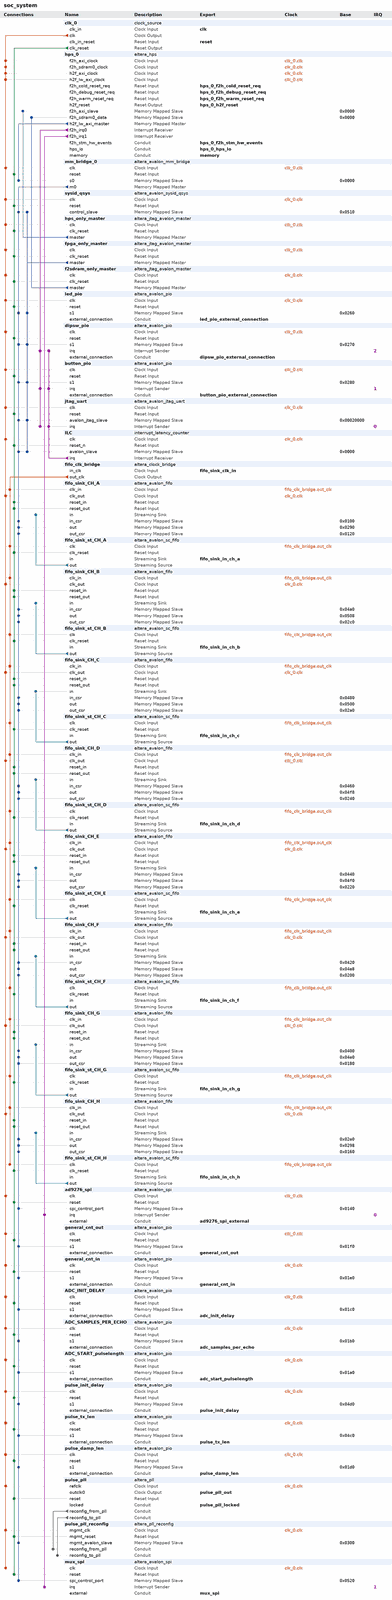
[diagram p0: system contents, whole]
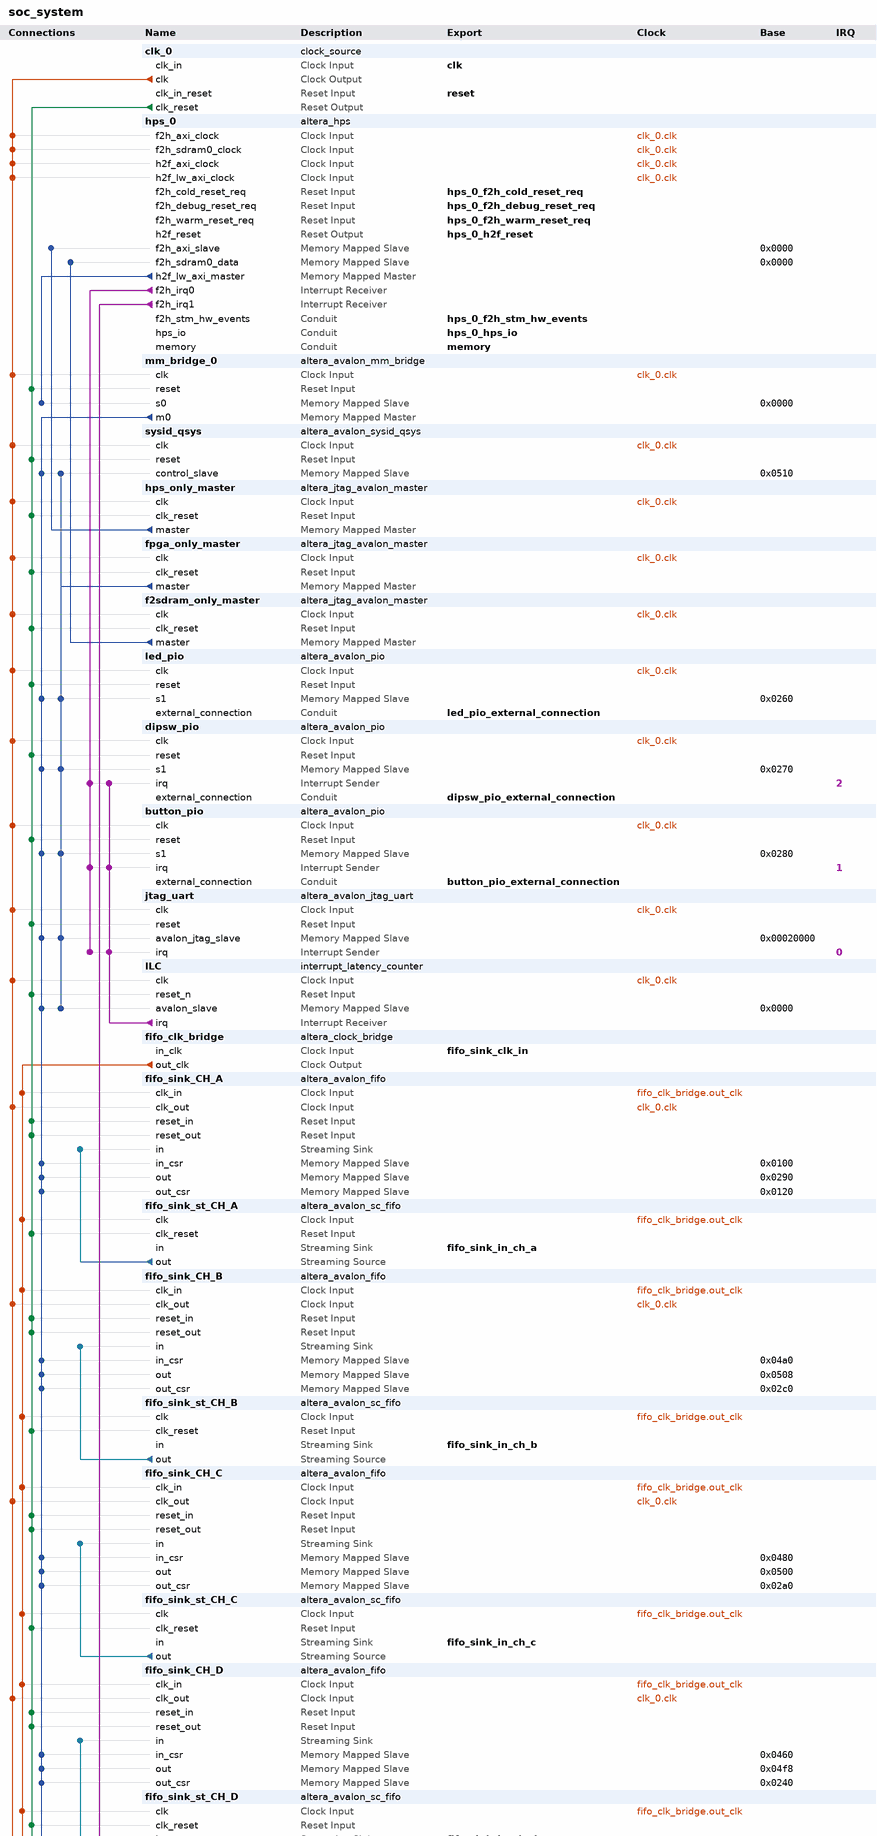
[diagram p1: system contents, upper part]
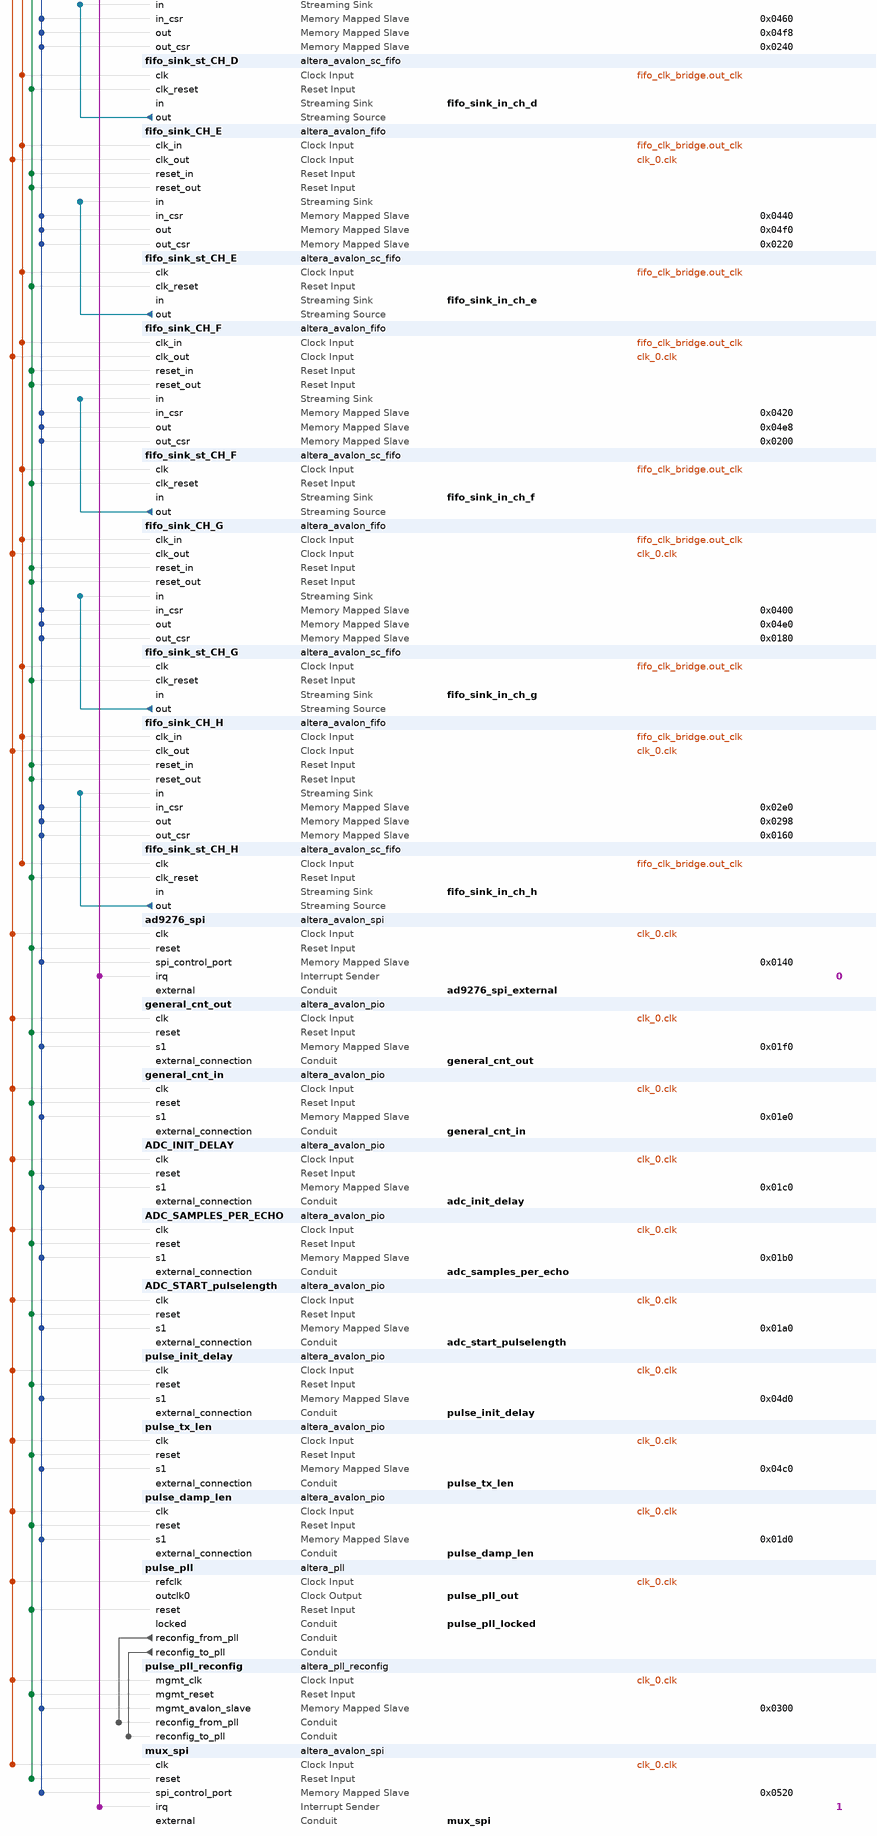
[diagram p2: system contents, lower part]
# Platform Designer (Qsys) system soc_system, Cyclone V 5CSXFC6D6F31C6
# Parameters at their usual value, and those the tool derives, are not listed.
package require -exact qsys 17.1
create_system soc_system
set_project_property DEVICE_FAMILY {Cyclone V}
set_project_property DEVICE 5CSXFC6D6F31C6

add_instance clk_0 clock_source 17.1
set_instance_parameter_value clk_0 clockFrequency 50000000

add_instance hps_0 altera_hps 17.1
set_instance_parameter_value hps_0 EMAC1_Mode RGMII
set_instance_parameter_value hps_0 EMAC1_PinMuxing {HPS I/O Set 0}
set_instance_parameter_value hps_0 F2SCLK_COLDRST_Enable true
set_instance_parameter_value hps_0 F2SCLK_DBGRST_Enable true
set_instance_parameter_value hps_0 F2SCLK_WARMRST_Enable true
set_instance_parameter_value hps_0 F2SDRAM_Type {Avalon-MM Bidirectional}
set_instance_parameter_value hps_0 F2SDRAM_Width 256
set_instance_parameter_value hps_0 F2SINTERRUPT_Enable true
set_instance_parameter_value hps_0 F2S_Width 2
set_instance_parameter_value hps_0 FPGA_PERIPHERAL_OUTPUT_CLOCK_FREQ_EMAC0_GTX_CLK 100
set_instance_parameter_value hps_0 FPGA_PERIPHERAL_OUTPUT_CLOCK_FREQ_EMAC0_MD_CLK 100.0
set_instance_parameter_value hps_0 FPGA_PERIPHERAL_OUTPUT_CLOCK_FREQ_EMAC1_GTX_CLK 100
set_instance_parameter_value hps_0 FPGA_PERIPHERAL_OUTPUT_CLOCK_FREQ_EMAC1_MD_CLK 100.0
set_instance_parameter_value hps_0 HPS_PROTOCOL DDR3
set_instance_parameter_value hps_0 I2C0_Mode I2C
set_instance_parameter_value hps_0 I2C0_PinMuxing {HPS I/O Set 0}
set_instance_parameter_value hps_0 I2C1_Mode I2C
set_instance_parameter_value hps_0 I2C1_PinMuxing {HPS I/O Set 0}
set_instance_parameter_value hps_0 LWH2F_Enable true
set_instance_parameter_value hps_0 MEM_BANKADDR_WIDTH 3
set_instance_parameter_value hps_0 MEM_CLK_FREQ 400.0
set_instance_parameter_value hps_0 MEM_COL_ADDR_WIDTH 10
set_instance_parameter_value hps_0 MEM_DQ_WIDTH 32
set_instance_parameter_value hps_0 MEM_DRV_STR RZQ/6
set_instance_parameter_value hps_0 MEM_ROW_ADDR_WIDTH 15
set_instance_parameter_value hps_0 MEM_RTT_NOM RZQ/6
set_instance_parameter_value hps_0 MEM_RTT_WR {Dynamic ODT off}
set_instance_parameter_value hps_0 MEM_TCL 11
set_instance_parameter_value hps_0 MEM_TFAW_NS 45.0
set_instance_parameter_value hps_0 MEM_TRAS_NS 35.0
set_instance_parameter_value hps_0 MEM_TRCD_NS 13.75
set_instance_parameter_value hps_0 MEM_TRFC_NS 260.0
set_instance_parameter_value hps_0 MEM_TRP_NS 13.75
set_instance_parameter_value hps_0 MEM_VENDOR Micron
set_instance_parameter_value hps_0 MEM_WTCL 7
set_instance_parameter_value hps_0 QSPI_Mode {1 SS}
set_instance_parameter_value hps_0 QSPI_PinMuxing {HPS I/O Set 0}
set_instance_parameter_value hps_0 REF_CLK_FREQ 25.0
set_instance_parameter_value hps_0 S2FCLK_USER2CLK 5
set_instance_parameter_value hps_0 S2F_Width 2
set_instance_parameter_value hps_0 SDIO_Mode {4-bit Data}
set_instance_parameter_value hps_0 SDIO_PinMuxing {HPS I/O Set 0}
set_instance_parameter_value hps_0 SPIM0_Mode {Single Slave Select}
set_instance_parameter_value hps_0 SPIM0_PinMuxing {HPS I/O Set 0}
set_instance_parameter_value hps_0 SPIM1_Mode {Single Slave Select}
set_instance_parameter_value hps_0 SPIM1_PinMuxing {HPS I/O Set 0}
set_instance_parameter_value hps_0 STM_Enable true
set_instance_parameter_value hps_0 TIMING_BOARD_AC_SKEW 0.02
set_instance_parameter_value hps_0 TIMING_BOARD_AC_TO_CK_SKEW 0.01
set_instance_parameter_value hps_0 TIMING_BOARD_DQ_TO_DQS_SKEW 0.05
set_instance_parameter_value hps_0 TIMING_BOARD_MAX_CK_DELAY 0.03
set_instance_parameter_value hps_0 TIMING_BOARD_MAX_DQS_DELAY 0.02
set_instance_parameter_value hps_0 TIMING_BOARD_SKEW_BETWEEN_DQS 0.06
set_instance_parameter_value hps_0 TIMING_BOARD_SKEW_CKDQS_DIMM_MAX 0.12
set_instance_parameter_value hps_0 TIMING_BOARD_SKEW_CKDQS_DIMM_MIN 0.06
set_instance_parameter_value hps_0 TIMING_BOARD_SKEW_WITHIN_DQS 0.01
set_instance_parameter_value hps_0 TIMING_TDH 65
set_instance_parameter_value hps_0 TIMING_TDQSCK 255
set_instance_parameter_value hps_0 TIMING_TDQSQ 125
set_instance_parameter_value hps_0 TIMING_TDS 30
set_instance_parameter_value hps_0 TIMING_TIH 140
set_instance_parameter_value hps_0 TIMING_TIS 190
set_instance_parameter_value hps_0 TIMING_TQSH 0.4
set_instance_parameter_value hps_0 UART0_Mode {No Flow Control}
set_instance_parameter_value hps_0 UART0_PinMuxing {HPS I/O Set 0}
set_instance_parameter_value hps_0 USB1_Mode SDR
set_instance_parameter_value hps_0 USB1_PinMuxing {HPS I/O Set 0}
set_instance_parameter_value hps_0 desired_cfg_clk_mhz 100.0
set_instance_parameter_value hps_0 desired_qspi_clk_mhz 400.0

add_instance mm_bridge_0 altera_avalon_mm_bridge 17.1
set_instance_parameter_value mm_bridge_0 ADDRESS_UNITS SYMBOLS
set_instance_parameter_value mm_bridge_0 ADDRESS_WIDTH 10
set_instance_parameter_value mm_bridge_0 DATA_WIDTH 32
set_instance_parameter_value mm_bridge_0 MAX_PENDING_RESPONSES 4
set_instance_parameter_value mm_bridge_0 USE_AUTO_ADDRESS_WIDTH 1

add_instance sysid_qsys altera_avalon_sysid_qsys 17.1
set_instance_parameter_value sysid_qsys id -1395322110

add_instance hps_only_master altera_jtag_avalon_master 17.1

add_instance fpga_only_master altera_jtag_avalon_master 17.1

add_instance f2sdram_only_master altera_jtag_avalon_master 17.1

add_instance led_pio altera_avalon_pio 17.1
set_instance_parameter_value led_pio direction Output
set_instance_parameter_value led_pio width 10

add_instance dipsw_pio altera_avalon_pio 17.1
set_instance_parameter_value dipsw_pio bitClearingEdgeCapReg true
set_instance_parameter_value dipsw_pio captureEdge true
set_instance_parameter_value dipsw_pio direction Input
set_instance_parameter_value dipsw_pio edgeType ANY
set_instance_parameter_value dipsw_pio generateIRQ true
set_instance_parameter_value dipsw_pio irqType EDGE
set_instance_parameter_value dipsw_pio width 10

add_instance button_pio altera_avalon_pio 17.1
set_instance_parameter_value button_pio bitClearingEdgeCapReg true
set_instance_parameter_value button_pio captureEdge true
set_instance_parameter_value button_pio direction Input
set_instance_parameter_value button_pio edgeType FALLING
set_instance_parameter_value button_pio generateIRQ true
set_instance_parameter_value button_pio irqType EDGE
set_instance_parameter_value button_pio width 4

add_instance jtag_uart altera_avalon_jtag_uart 17.1
set_instance_parameter_value jtag_uart allowMultipleConnections true
set_instance_parameter_value jtag_uart simInteractiveOptions INTERACTIVE_ASCII_OUTPUT

add_instance ILC interrupt_latency_counter 17.1

add_instance fifo_clk_bridge altera_clock_bridge 17.1
set_instance_parameter_value fifo_clk_bridge DERIVED_CLOCK_RATE 0
set_instance_parameter_value fifo_clk_bridge EXPLICIT_CLOCK_RATE 0

add_instance fifo_sink_CH_A altera_avalon_fifo 17.1
set_instance_parameter_value fifo_sink_CH_A bitsPerSymbol 16
set_instance_parameter_value fifo_sink_CH_A channelWidth 0
set_instance_parameter_value fifo_sink_CH_A errorWidth 0
set_instance_parameter_value fifo_sink_CH_A fifoDepth 4096
set_instance_parameter_value fifo_sink_CH_A fifoInputInterfaceOptions AVALONST_SINK
set_instance_parameter_value fifo_sink_CH_A fifoOutputInterfaceOptions AVALONMM_READ
set_instance_parameter_value fifo_sink_CH_A singleClockMode false
set_instance_parameter_value fifo_sink_CH_A symbolsPerBeat 2
set_instance_parameter_value fifo_sink_CH_A useIRQ false
set_instance_parameter_value fifo_sink_CH_A usePacket false
set_instance_parameter_value fifo_sink_CH_A useReadControl true

add_instance fifo_sink_st_CH_A altera_avalon_sc_fifo 17.1
set_instance_parameter_value fifo_sink_st_CH_A BITS_PER_SYMBOL 16
set_instance_parameter_value fifo_sink_st_CH_A CHANNEL_WIDTH 0
set_instance_parameter_value fifo_sink_st_CH_A ERROR_WIDTH 0
set_instance_parameter_value fifo_sink_st_CH_A FIFO_DEPTH 16
set_instance_parameter_value fifo_sink_st_CH_A USE_FILL_LEVEL 0
set_instance_parameter_value fifo_sink_st_CH_A USE_MEMORY_BLOCKS 1
set_instance_parameter_value fifo_sink_st_CH_A USE_STORE_FORWARD 0

add_instance fifo_sink_CH_B altera_avalon_fifo 17.1
set_instance_parameter_value fifo_sink_CH_B bitsPerSymbol 16
set_instance_parameter_value fifo_sink_CH_B channelWidth 0
set_instance_parameter_value fifo_sink_CH_B errorWidth 0
set_instance_parameter_value fifo_sink_CH_B fifoDepth 4096
set_instance_parameter_value fifo_sink_CH_B fifoInputInterfaceOptions AVALONST_SINK
set_instance_parameter_value fifo_sink_CH_B fifoOutputInterfaceOptions AVALONMM_READ
set_instance_parameter_value fifo_sink_CH_B singleClockMode false
set_instance_parameter_value fifo_sink_CH_B symbolsPerBeat 2
set_instance_parameter_value fifo_sink_CH_B useIRQ false
set_instance_parameter_value fifo_sink_CH_B usePacket false
set_instance_parameter_value fifo_sink_CH_B useReadControl true

add_instance fifo_sink_st_CH_B altera_avalon_sc_fifo 17.1
set_instance_parameter_value fifo_sink_st_CH_B BITS_PER_SYMBOL 16
set_instance_parameter_value fifo_sink_st_CH_B CHANNEL_WIDTH 0
set_instance_parameter_value fifo_sink_st_CH_B ERROR_WIDTH 0
set_instance_parameter_value fifo_sink_st_CH_B FIFO_DEPTH 16
set_instance_parameter_value fifo_sink_st_CH_B USE_FILL_LEVEL 0
set_instance_parameter_value fifo_sink_st_CH_B USE_MEMORY_BLOCKS 1
set_instance_parameter_value fifo_sink_st_CH_B USE_STORE_FORWARD 0

add_instance fifo_sink_CH_C altera_avalon_fifo 17.1
set_instance_parameter_value fifo_sink_CH_C bitsPerSymbol 16
set_instance_parameter_value fifo_sink_CH_C channelWidth 0
set_instance_parameter_value fifo_sink_CH_C errorWidth 0
set_instance_parameter_value fifo_sink_CH_C fifoDepth 4096
set_instance_parameter_value fifo_sink_CH_C fifoInputInterfaceOptions AVALONST_SINK
set_instance_parameter_value fifo_sink_CH_C fifoOutputInterfaceOptions AVALONMM_READ
set_instance_parameter_value fifo_sink_CH_C singleClockMode false
set_instance_parameter_value fifo_sink_CH_C symbolsPerBeat 2
set_instance_parameter_value fifo_sink_CH_C useIRQ false
set_instance_parameter_value fifo_sink_CH_C usePacket false
set_instance_parameter_value fifo_sink_CH_C useReadControl true

add_instance fifo_sink_st_CH_C altera_avalon_sc_fifo 17.1
set_instance_parameter_value fifo_sink_st_CH_C BITS_PER_SYMBOL 16
set_instance_parameter_value fifo_sink_st_CH_C CHANNEL_WIDTH 0
set_instance_parameter_value fifo_sink_st_CH_C ERROR_WIDTH 0
set_instance_parameter_value fifo_sink_st_CH_C FIFO_DEPTH 16
set_instance_parameter_value fifo_sink_st_CH_C USE_FILL_LEVEL 0
set_instance_parameter_value fifo_sink_st_CH_C USE_MEMORY_BLOCKS 1
set_instance_parameter_value fifo_sink_st_CH_C USE_STORE_FORWARD 0

add_instance fifo_sink_CH_D altera_avalon_fifo 17.1
set_instance_parameter_value fifo_sink_CH_D bitsPerSymbol 16
set_instance_parameter_value fifo_sink_CH_D channelWidth 0
set_instance_parameter_value fifo_sink_CH_D errorWidth 0
set_instance_parameter_value fifo_sink_CH_D fifoDepth 4096
set_instance_parameter_value fifo_sink_CH_D fifoInputInterfaceOptions AVALONST_SINK
set_instance_parameter_value fifo_sink_CH_D fifoOutputInterfaceOptions AVALONMM_READ
set_instance_parameter_value fifo_sink_CH_D singleClockMode false
set_instance_parameter_value fifo_sink_CH_D symbolsPerBeat 2
set_instance_parameter_value fifo_sink_CH_D useIRQ false
set_instance_parameter_value fifo_sink_CH_D usePacket false
set_instance_parameter_value fifo_sink_CH_D useReadControl true

add_instance fifo_sink_st_CH_D altera_avalon_sc_fifo 17.1
set_instance_parameter_value fifo_sink_st_CH_D BITS_PER_SYMBOL 16
set_instance_parameter_value fifo_sink_st_CH_D CHANNEL_WIDTH 0
set_instance_parameter_value fifo_sink_st_CH_D ERROR_WIDTH 0
set_instance_parameter_value fifo_sink_st_CH_D FIFO_DEPTH 16
set_instance_parameter_value fifo_sink_st_CH_D USE_FILL_LEVEL 0
set_instance_parameter_value fifo_sink_st_CH_D USE_MEMORY_BLOCKS 1
set_instance_parameter_value fifo_sink_st_CH_D USE_STORE_FORWARD 0

add_instance fifo_sink_CH_E altera_avalon_fifo 17.1
set_instance_parameter_value fifo_sink_CH_E bitsPerSymbol 16
set_instance_parameter_value fifo_sink_CH_E channelWidth 0
set_instance_parameter_value fifo_sink_CH_E errorWidth 0
set_instance_parameter_value fifo_sink_CH_E fifoDepth 4096
set_instance_parameter_value fifo_sink_CH_E fifoInputInterfaceOptions AVALONST_SINK
set_instance_parameter_value fifo_sink_CH_E fifoOutputInterfaceOptions AVALONMM_READ
set_instance_parameter_value fifo_sink_CH_E singleClockMode false
set_instance_parameter_value fifo_sink_CH_E symbolsPerBeat 2
set_instance_parameter_value fifo_sink_CH_E useIRQ false
set_instance_parameter_value fifo_sink_CH_E usePacket false
set_instance_parameter_value fifo_sink_CH_E useReadControl true

add_instance fifo_sink_st_CH_E altera_avalon_sc_fifo 17.1
set_instance_parameter_value fifo_sink_st_CH_E BITS_PER_SYMBOL 16
set_instance_parameter_value fifo_sink_st_CH_E CHANNEL_WIDTH 0
set_instance_parameter_value fifo_sink_st_CH_E ERROR_WIDTH 0
set_instance_parameter_value fifo_sink_st_CH_E FIFO_DEPTH 16
set_instance_parameter_value fifo_sink_st_CH_E USE_FILL_LEVEL 0
set_instance_parameter_value fifo_sink_st_CH_E USE_MEMORY_BLOCKS 1
set_instance_parameter_value fifo_sink_st_CH_E USE_STORE_FORWARD 0

add_instance fifo_sink_CH_F altera_avalon_fifo 17.1
set_instance_parameter_value fifo_sink_CH_F bitsPerSymbol 16
set_instance_parameter_value fifo_sink_CH_F channelWidth 0
set_instance_parameter_value fifo_sink_CH_F errorWidth 0
set_instance_parameter_value fifo_sink_CH_F fifoDepth 4096
set_instance_parameter_value fifo_sink_CH_F fifoInputInterfaceOptions AVALONST_SINK
set_instance_parameter_value fifo_sink_CH_F fifoOutputInterfaceOptions AVALONMM_READ
set_instance_parameter_value fifo_sink_CH_F singleClockMode false
set_instance_parameter_value fifo_sink_CH_F symbolsPerBeat 2
set_instance_parameter_value fifo_sink_CH_F useIRQ false
set_instance_parameter_value fifo_sink_CH_F usePacket false
set_instance_parameter_value fifo_sink_CH_F useReadControl true

add_instance fifo_sink_st_CH_F altera_avalon_sc_fifo 17.1
set_instance_parameter_value fifo_sink_st_CH_F BITS_PER_SYMBOL 16
set_instance_parameter_value fifo_sink_st_CH_F CHANNEL_WIDTH 0
set_instance_parameter_value fifo_sink_st_CH_F ERROR_WIDTH 0
set_instance_parameter_value fifo_sink_st_CH_F FIFO_DEPTH 16
set_instance_parameter_value fifo_sink_st_CH_F USE_FILL_LEVEL 0
set_instance_parameter_value fifo_sink_st_CH_F USE_MEMORY_BLOCKS 1
set_instance_parameter_value fifo_sink_st_CH_F USE_STORE_FORWARD 0

add_instance fifo_sink_CH_G altera_avalon_fifo 17.1
set_instance_parameter_value fifo_sink_CH_G bitsPerSymbol 16
set_instance_parameter_value fifo_sink_CH_G channelWidth 0
set_instance_parameter_value fifo_sink_CH_G errorWidth 0
set_instance_parameter_value fifo_sink_CH_G fifoDepth 4096
set_instance_parameter_value fifo_sink_CH_G fifoInputInterfaceOptions AVALONST_SINK
set_instance_parameter_value fifo_sink_CH_G fifoOutputInterfaceOptions AVALONMM_READ
set_instance_parameter_value fifo_sink_CH_G singleClockMode false
set_instance_parameter_value fifo_sink_CH_G symbolsPerBeat 2
set_instance_parameter_value fifo_sink_CH_G useIRQ false
set_instance_parameter_value fifo_sink_CH_G usePacket false
set_instance_parameter_value fifo_sink_CH_G useReadControl true

add_instance fifo_sink_st_CH_G altera_avalon_sc_fifo 17.1
set_instance_parameter_value fifo_sink_st_CH_G BITS_PER_SYMBOL 16
set_instance_parameter_value fifo_sink_st_CH_G CHANNEL_WIDTH 0
set_instance_parameter_value fifo_sink_st_CH_G ERROR_WIDTH 0
set_instance_parameter_value fifo_sink_st_CH_G FIFO_DEPTH 16
set_instance_parameter_value fifo_sink_st_CH_G USE_FILL_LEVEL 0
set_instance_parameter_value fifo_sink_st_CH_G USE_MEMORY_BLOCKS 1
set_instance_parameter_value fifo_sink_st_CH_G USE_STORE_FORWARD 0

add_instance fifo_sink_CH_H altera_avalon_fifo 17.1
set_instance_parameter_value fifo_sink_CH_H bitsPerSymbol 16
set_instance_parameter_value fifo_sink_CH_H channelWidth 0
set_instance_parameter_value fifo_sink_CH_H errorWidth 0
set_instance_parameter_value fifo_sink_CH_H fifoDepth 4096
set_instance_parameter_value fifo_sink_CH_H fifoInputInterfaceOptions AVALONST_SINK
set_instance_parameter_value fifo_sink_CH_H fifoOutputInterfaceOptions AVALONMM_READ
set_instance_parameter_value fifo_sink_CH_H singleClockMode false
set_instance_parameter_value fifo_sink_CH_H symbolsPerBeat 2
set_instance_parameter_value fifo_sink_CH_H useIRQ false
set_instance_parameter_value fifo_sink_CH_H usePacket false
set_instance_parameter_value fifo_sink_CH_H useReadControl true

add_instance fifo_sink_st_CH_H altera_avalon_sc_fifo 17.1
set_instance_parameter_value fifo_sink_st_CH_H BITS_PER_SYMBOL 16
set_instance_parameter_value fifo_sink_st_CH_H CHANNEL_WIDTH 0
set_instance_parameter_value fifo_sink_st_CH_H ERROR_WIDTH 0
set_instance_parameter_value fifo_sink_st_CH_H FIFO_DEPTH 16
set_instance_parameter_value fifo_sink_st_CH_H USE_FILL_LEVEL 0
set_instance_parameter_value fifo_sink_st_CH_H USE_MEMORY_BLOCKS 1
set_instance_parameter_value fifo_sink_st_CH_H USE_STORE_FORWARD 0

add_instance ad9276_spi altera_avalon_spi 17.1
set_instance_parameter_value ad9276_spi clockPolarity 0
set_instance_parameter_value ad9276_spi dataWidth 24
set_instance_parameter_value ad9276_spi masterSPI true
set_instance_parameter_value ad9276_spi numberOfSlaves 1
set_instance_parameter_value ad9276_spi targetClockRate 4200000
set_instance_parameter_value ad9276_spi targetSlaveSelectToSClkDelay 2000.0

add_instance general_cnt_out altera_avalon_pio 17.1
set_instance_parameter_value general_cnt_out direction Output
set_instance_parameter_value general_cnt_out width 32

add_instance general_cnt_in altera_avalon_pio 17.1
set_instance_parameter_value general_cnt_in direction Input
set_instance_parameter_value general_cnt_in width 32

add_instance ADC_INIT_DELAY altera_avalon_pio 17.1
set_instance_parameter_value ADC_INIT_DELAY direction Output
set_instance_parameter_value ADC_INIT_DELAY width 32

add_instance ADC_SAMPLES_PER_ECHO altera_avalon_pio 17.1
set_instance_parameter_value ADC_SAMPLES_PER_ECHO direction Output
set_instance_parameter_value ADC_SAMPLES_PER_ECHO width 32

add_instance ADC_START_pulselength altera_avalon_pio 17.1
set_instance_parameter_value ADC_START_pulselength direction Output
set_instance_parameter_value ADC_START_pulselength width 32

add_instance pulse_init_delay altera_avalon_pio 17.1
set_instance_parameter_value pulse_init_delay direction Output
set_instance_parameter_value pulse_init_delay width 8

add_instance pulse_tx_len altera_avalon_pio 17.1
set_instance_parameter_value pulse_tx_len direction Output
set_instance_parameter_value pulse_tx_len width 8

add_instance pulse_damp_len altera_avalon_pio 17.1
set_instance_parameter_value pulse_damp_len direction Output
set_instance_parameter_value pulse_damp_len width 8

add_instance pulse_pll altera_pll 17.1
set_instance_parameter_value pulse_pll gui_device_speed_grade 1
set_instance_parameter_value pulse_pll gui_en_reconf true
set_instance_parameter_value pulse_pll gui_number_of_clocks 1
set_instance_parameter_value pulse_pll gui_operation_mode direct
set_instance_parameter_value pulse_pll gui_output_clock_frequency0 4.0
set_instance_parameter_value pulse_pll gui_pll_mode {Fractional-N PLL}
set_instance_parameter_value pulse_pll gui_reference_clock_frequency 50.0
set_instance_parameter_value pulse_pll gui_use_locked true

add_instance pulse_pll_reconfig altera_pll_reconfig 17.1

add_instance mux_spi altera_avalon_spi 17.1
set_instance_parameter_value mux_spi clockPolarity 0
set_instance_parameter_value mux_spi dataWidth 8
set_instance_parameter_value mux_spi masterSPI true
set_instance_parameter_value mux_spi numberOfSlaves 1
set_instance_parameter_value mux_spi targetClockRate 128000

# connections
add_connection clk_0.clk ad9276_spi.clk clock
add_connection clk_0.clk ADC_INIT_DELAY.clk clock
add_connection clk_0.clk ADC_SAMPLES_PER_ECHO.clk clock
add_connection clk_0.clk ADC_START_pulselength.clk clock
add_connection clk_0.clk button_pio.clk clock
add_connection clk_0.clk dipsw_pio.clk clock
add_connection clk_0.clk f2sdram_only_master.clk clock
add_connection clk_0.clk fifo_sink_CH_A.clk_out clock
add_connection clk_0.clk fifo_sink_CH_B.clk_out clock
add_connection clk_0.clk fifo_sink_CH_C.clk_out clock
add_connection clk_0.clk fifo_sink_CH_D.clk_out clock
add_connection clk_0.clk fifo_sink_CH_E.clk_out clock
add_connection clk_0.clk fifo_sink_CH_F.clk_out clock
add_connection clk_0.clk fifo_sink_CH_G.clk_out clock
add_connection clk_0.clk fifo_sink_CH_H.clk_out clock
add_connection clk_0.clk fpga_only_master.clk clock
add_connection clk_0.clk general_cnt_in.clk clock
add_connection clk_0.clk general_cnt_out.clk clock
add_connection clk_0.clk hps_0.f2h_axi_clock clock
add_connection clk_0.clk hps_0.f2h_sdram0_clock clock
add_connection clk_0.clk hps_0.h2f_axi_clock clock
add_connection clk_0.clk hps_0.h2f_lw_axi_clock clock
add_connection clk_0.clk hps_only_master.clk clock
add_connection clk_0.clk ILC.clk clock
add_connection clk_0.clk jtag_uart.clk clock
add_connection clk_0.clk led_pio.clk clock
add_connection clk_0.clk mm_bridge_0.clk clock
add_connection clk_0.clk mux_spi.clk clock
add_connection clk_0.clk pulse_damp_len.clk clock
add_connection clk_0.clk pulse_init_delay.clk clock
add_connection clk_0.clk pulse_pll.refclk clock
add_connection clk_0.clk pulse_pll_reconfig.mgmt_clk clock
add_connection clk_0.clk pulse_tx_len.clk clock
add_connection clk_0.clk sysid_qsys.clk clock
add_connection fifo_clk_bridge.out_clk fifo_sink_CH_A.clk_in clock
add_connection fifo_clk_bridge.out_clk fifo_sink_CH_B.clk_in clock
add_connection fifo_clk_bridge.out_clk fifo_sink_CH_C.clk_in clock
add_connection fifo_clk_bridge.out_clk fifo_sink_CH_D.clk_in clock
add_connection fifo_clk_bridge.out_clk fifo_sink_CH_E.clk_in clock
add_connection fifo_clk_bridge.out_clk fifo_sink_CH_F.clk_in clock
add_connection fifo_clk_bridge.out_clk fifo_sink_CH_G.clk_in clock
add_connection fifo_clk_bridge.out_clk fifo_sink_CH_H.clk_in clock
add_connection fifo_clk_bridge.out_clk fifo_sink_st_CH_A.clk clock
add_connection fifo_clk_bridge.out_clk fifo_sink_st_CH_B.clk clock
add_connection fifo_clk_bridge.out_clk fifo_sink_st_CH_C.clk clock
add_connection fifo_clk_bridge.out_clk fifo_sink_st_CH_D.clk clock
add_connection fifo_clk_bridge.out_clk fifo_sink_st_CH_E.clk clock
add_connection fifo_clk_bridge.out_clk fifo_sink_st_CH_F.clk clock
add_connection fifo_clk_bridge.out_clk fifo_sink_st_CH_G.clk clock
add_connection fifo_clk_bridge.out_clk fifo_sink_st_CH_H.clk clock
add_connection clk_0.clk_reset ad9276_spi.reset reset
add_connection clk_0.clk_reset ADC_INIT_DELAY.reset reset
add_connection clk_0.clk_reset ADC_SAMPLES_PER_ECHO.reset reset
add_connection clk_0.clk_reset ADC_START_pulselength.reset reset
add_connection clk_0.clk_reset button_pio.reset reset
add_connection clk_0.clk_reset dipsw_pio.reset reset
add_connection clk_0.clk_reset f2sdram_only_master.clk_reset reset
add_connection clk_0.clk_reset fifo_sink_CH_A.reset_in reset
add_connection clk_0.clk_reset fifo_sink_CH_A.reset_out reset
add_connection clk_0.clk_reset fifo_sink_CH_B.reset_in reset
add_connection clk_0.clk_reset fifo_sink_CH_B.reset_out reset
add_connection clk_0.clk_reset fifo_sink_CH_C.reset_in reset
add_connection clk_0.clk_reset fifo_sink_CH_C.reset_out reset
add_connection clk_0.clk_reset fifo_sink_CH_D.reset_in reset
add_connection clk_0.clk_reset fifo_sink_CH_D.reset_out reset
add_connection clk_0.clk_reset fifo_sink_CH_E.reset_in reset
add_connection clk_0.clk_reset fifo_sink_CH_E.reset_out reset
add_connection clk_0.clk_reset fifo_sink_CH_F.reset_in reset
add_connection clk_0.clk_reset fifo_sink_CH_F.reset_out reset
add_connection clk_0.clk_reset fifo_sink_CH_G.reset_in reset
add_connection clk_0.clk_reset fifo_sink_CH_G.reset_out reset
add_connection clk_0.clk_reset fifo_sink_CH_H.reset_in reset
add_connection clk_0.clk_reset fifo_sink_CH_H.reset_out reset
add_connection clk_0.clk_reset fifo_sink_st_CH_A.clk_reset reset
add_connection clk_0.clk_reset fifo_sink_st_CH_B.clk_reset reset
add_connection clk_0.clk_reset fifo_sink_st_CH_C.clk_reset reset
add_connection clk_0.clk_reset fifo_sink_st_CH_D.clk_reset reset
add_connection clk_0.clk_reset fifo_sink_st_CH_E.clk_reset reset
add_connection clk_0.clk_reset fifo_sink_st_CH_F.clk_reset reset
add_connection clk_0.clk_reset fifo_sink_st_CH_G.clk_reset reset
add_connection clk_0.clk_reset fifo_sink_st_CH_H.clk_reset reset
add_connection clk_0.clk_reset fpga_only_master.clk_reset reset
add_connection clk_0.clk_reset general_cnt_in.reset reset
add_connection clk_0.clk_reset general_cnt_out.reset reset
add_connection clk_0.clk_reset hps_only_master.clk_reset reset
add_connection clk_0.clk_reset ILC.reset_n reset
add_connection clk_0.clk_reset jtag_uart.reset reset
add_connection clk_0.clk_reset led_pio.reset reset
add_connection clk_0.clk_reset mm_bridge_0.reset reset
add_connection clk_0.clk_reset mux_spi.reset reset
add_connection clk_0.clk_reset pulse_damp_len.reset reset
add_connection clk_0.clk_reset pulse_init_delay.reset reset
add_connection clk_0.clk_reset pulse_pll.reset reset
add_connection clk_0.clk_reset pulse_pll_reconfig.mgmt_reset reset
add_connection clk_0.clk_reset pulse_tx_len.reset reset
add_connection clk_0.clk_reset sysid_qsys.reset reset
add_connection f2sdram_only_master.master hps_0.f2h_sdram0_data avalon
set_connection_parameter_value f2sdram_only_master.master/hps_0.f2h_sdram0_data baseAddress 0x0000
add_connection fpga_only_master.master button_pio.s1 avalon
set_connection_parameter_value fpga_only_master.master/button_pio.s1 baseAddress 0x0280
add_connection fpga_only_master.master dipsw_pio.s1 avalon
set_connection_parameter_value fpga_only_master.master/dipsw_pio.s1 baseAddress 0x0270
add_connection fpga_only_master.master ILC.avalon_slave avalon
set_connection_parameter_value fpga_only_master.master/ILC.avalon_slave baseAddress 0x0000
add_connection fpga_only_master.master jtag_uart.avalon_jtag_slave avalon
set_connection_parameter_value fpga_only_master.master/jtag_uart.avalon_jtag_slave baseAddress 0x00020000
add_connection fpga_only_master.master led_pio.s1 avalon
set_connection_parameter_value fpga_only_master.master/led_pio.s1 baseAddress 0x0260
add_connection fpga_only_master.master sysid_qsys.control_slave avalon
set_connection_parameter_value fpga_only_master.master/sysid_qsys.control_slave baseAddress 0x0510
add_connection hps_0.h2f_lw_axi_master mm_bridge_0.s0 avalon
set_connection_parameter_value hps_0.h2f_lw_axi_master/mm_bridge_0.s0 baseAddress 0x0000
add_connection hps_only_master.master hps_0.f2h_axi_slave avalon
set_connection_parameter_value hps_only_master.master/hps_0.f2h_axi_slave baseAddress 0x0000
add_connection mm_bridge_0.m0 ad9276_spi.spi_control_port avalon
set_connection_parameter_value mm_bridge_0.m0/ad9276_spi.spi_control_port baseAddress 0x0140
add_connection mm_bridge_0.m0 ADC_INIT_DELAY.s1 avalon
set_connection_parameter_value mm_bridge_0.m0/ADC_INIT_DELAY.s1 baseAddress 0x01c0
add_connection mm_bridge_0.m0 ADC_SAMPLES_PER_ECHO.s1 avalon
set_connection_parameter_value mm_bridge_0.m0/ADC_SAMPLES_PER_ECHO.s1 baseAddress 0x01b0
add_connection mm_bridge_0.m0 ADC_START_pulselength.s1 avalon
set_connection_parameter_value mm_bridge_0.m0/ADC_START_pulselength.s1 baseAddress 0x01a0
add_connection mm_bridge_0.m0 button_pio.s1 avalon
set_connection_parameter_value mm_bridge_0.m0/button_pio.s1 baseAddress 0x0280
add_connection mm_bridge_0.m0 dipsw_pio.s1 avalon
set_connection_parameter_value mm_bridge_0.m0/dipsw_pio.s1 baseAddress 0x0270
add_connection mm_bridge_0.m0 fifo_sink_CH_A.in_csr avalon
set_connection_parameter_value mm_bridge_0.m0/fifo_sink_CH_A.in_csr baseAddress 0x0100
add_connection mm_bridge_0.m0 fifo_sink_CH_A.out avalon
set_connection_parameter_value mm_bridge_0.m0/fifo_sink_CH_A.out baseAddress 0x0290
add_connection mm_bridge_0.m0 fifo_sink_CH_A.out_csr avalon
set_connection_parameter_value mm_bridge_0.m0/fifo_sink_CH_A.out_csr baseAddress 0x0120
add_connection mm_bridge_0.m0 fifo_sink_CH_B.in_csr avalon
set_connection_parameter_value mm_bridge_0.m0/fifo_sink_CH_B.in_csr baseAddress 0x04a0
add_connection mm_bridge_0.m0 fifo_sink_CH_B.out avalon
set_connection_parameter_value mm_bridge_0.m0/fifo_sink_CH_B.out baseAddress 0x0508
add_connection mm_bridge_0.m0 fifo_sink_CH_B.out_csr avalon
set_connection_parameter_value mm_bridge_0.m0/fifo_sink_CH_B.out_csr baseAddress 0x02c0
add_connection mm_bridge_0.m0 fifo_sink_CH_C.in_csr avalon
set_connection_parameter_value mm_bridge_0.m0/fifo_sink_CH_C.in_csr baseAddress 0x0480
add_connection mm_bridge_0.m0 fifo_sink_CH_C.out avalon
set_connection_parameter_value mm_bridge_0.m0/fifo_sink_CH_C.out baseAddress 0x0500
add_connection mm_bridge_0.m0 fifo_sink_CH_C.out_csr avalon
set_connection_parameter_value mm_bridge_0.m0/fifo_sink_CH_C.out_csr baseAddress 0x02a0
add_connection mm_bridge_0.m0 fifo_sink_CH_D.in_csr avalon
set_connection_parameter_value mm_bridge_0.m0/fifo_sink_CH_D.in_csr baseAddress 0x0460
add_connection mm_bridge_0.m0 fifo_sink_CH_D.out avalon
set_connection_parameter_value mm_bridge_0.m0/fifo_sink_CH_D.out baseAddress 0x04f8
add_connection mm_bridge_0.m0 fifo_sink_CH_D.out_csr avalon
set_connection_parameter_value mm_bridge_0.m0/fifo_sink_CH_D.out_csr baseAddress 0x0240
add_connection mm_bridge_0.m0 fifo_sink_CH_E.in_csr avalon
set_connection_parameter_value mm_bridge_0.m0/fifo_sink_CH_E.in_csr baseAddress 0x0440
add_connection mm_bridge_0.m0 fifo_sink_CH_E.out avalon
set_connection_parameter_value mm_bridge_0.m0/fifo_sink_CH_E.out baseAddress 0x04f0
add_connection mm_bridge_0.m0 fifo_sink_CH_E.out_csr avalon
set_connection_parameter_value mm_bridge_0.m0/fifo_sink_CH_E.out_csr baseAddress 0x0220
add_connection mm_bridge_0.m0 fifo_sink_CH_F.in_csr avalon
set_connection_parameter_value mm_bridge_0.m0/fifo_sink_CH_F.in_csr baseAddress 0x0420
add_connection mm_bridge_0.m0 fifo_sink_CH_F.out avalon
set_connection_parameter_value mm_bridge_0.m0/fifo_sink_CH_F.out baseAddress 0x04e8
add_connection mm_bridge_0.m0 fifo_sink_CH_F.out_csr avalon
set_connection_parameter_value mm_bridge_0.m0/fifo_sink_CH_F.out_csr baseAddress 0x0200
add_connection mm_bridge_0.m0 fifo_sink_CH_G.in_csr avalon
set_connection_parameter_value mm_bridge_0.m0/fifo_sink_CH_G.in_csr baseAddress 0x0400
add_connection mm_bridge_0.m0 fifo_sink_CH_G.out avalon
set_connection_parameter_value mm_bridge_0.m0/fifo_sink_CH_G.out baseAddress 0x04e0
add_connection mm_bridge_0.m0 fifo_sink_CH_G.out_csr avalon
set_connection_parameter_value mm_bridge_0.m0/fifo_sink_CH_G.out_csr baseAddress 0x0180
add_connection mm_bridge_0.m0 fifo_sink_CH_H.in_csr avalon
set_connection_parameter_value mm_bridge_0.m0/fifo_sink_CH_H.in_csr baseAddress 0x02e0
add_connection mm_bridge_0.m0 fifo_sink_CH_H.out avalon
set_connection_parameter_value mm_bridge_0.m0/fifo_sink_CH_H.out baseAddress 0x0298
add_connection mm_bridge_0.m0 fifo_sink_CH_H.out_csr avalon
set_connection_parameter_value mm_bridge_0.m0/fifo_sink_CH_H.out_csr baseAddress 0x0160
add_connection mm_bridge_0.m0 general_cnt_in.s1 avalon
set_connection_parameter_value mm_bridge_0.m0/general_cnt_in.s1 baseAddress 0x01e0
add_connection mm_bridge_0.m0 general_cnt_out.s1 avalon
set_connection_parameter_value mm_bridge_0.m0/general_cnt_out.s1 baseAddress 0x01f0
add_connection mm_bridge_0.m0 ILC.avalon_slave avalon
set_connection_parameter_value mm_bridge_0.m0/ILC.avalon_slave baseAddress 0x0000
add_connection mm_bridge_0.m0 jtag_uart.avalon_jtag_slave avalon
set_connection_parameter_value mm_bridge_0.m0/jtag_uart.avalon_jtag_slave baseAddress 0x00020000
add_connection mm_bridge_0.m0 led_pio.s1 avalon
set_connection_parameter_value mm_bridge_0.m0/led_pio.s1 baseAddress 0x0260
add_connection mm_bridge_0.m0 mux_spi.spi_control_port avalon
set_connection_parameter_value mm_bridge_0.m0/mux_spi.spi_control_port baseAddress 0x0520
add_connection mm_bridge_0.m0 pulse_damp_len.s1 avalon
set_connection_parameter_value mm_bridge_0.m0/pulse_damp_len.s1 baseAddress 0x01d0
add_connection mm_bridge_0.m0 pulse_init_delay.s1 avalon
set_connection_parameter_value mm_bridge_0.m0/pulse_init_delay.s1 baseAddress 0x04d0
add_connection mm_bridge_0.m0 pulse_pll_reconfig.mgmt_avalon_slave avalon
set_connection_parameter_value mm_bridge_0.m0/pulse_pll_reconfig.mgmt_avalon_slave baseAddress 0x0300
add_connection mm_bridge_0.m0 pulse_tx_len.s1 avalon
set_connection_parameter_value mm_bridge_0.m0/pulse_tx_len.s1 baseAddress 0x04c0
add_connection mm_bridge_0.m0 sysid_qsys.control_slave avalon
set_connection_parameter_value mm_bridge_0.m0/sysid_qsys.control_slave baseAddress 0x0510
add_connection fifo_sink_st_CH_A.out fifo_sink_CH_A.in avalon_streaming
add_connection fifo_sink_st_CH_B.out fifo_sink_CH_B.in avalon_streaming
add_connection fifo_sink_st_CH_C.out fifo_sink_CH_C.in avalon_streaming
add_connection fifo_sink_st_CH_D.out fifo_sink_CH_D.in avalon_streaming
add_connection fifo_sink_st_CH_E.out fifo_sink_CH_E.in avalon_streaming
add_connection fifo_sink_st_CH_F.out fifo_sink_CH_F.in avalon_streaming
add_connection fifo_sink_st_CH_G.out fifo_sink_CH_G.in avalon_streaming
add_connection fifo_sink_st_CH_H.out fifo_sink_CH_H.in avalon_streaming
add_connection pulse_pll.reconfig_from_pll pulse_pll_reconfig.reconfig_from_pll conduit
add_connection pulse_pll.reconfig_to_pll pulse_pll_reconfig.reconfig_to_pll conduit
add_connection hps_0.f2h_irq0 button_pio.irq interrupt
set_connection_parameter_value hps_0.f2h_irq0/button_pio.irq irqNumber 1
add_connection hps_0.f2h_irq0 dipsw_pio.irq interrupt
set_connection_parameter_value hps_0.f2h_irq0/dipsw_pio.irq irqNumber 0
add_connection hps_0.f2h_irq0 jtag_uart.irq interrupt
set_connection_parameter_value hps_0.f2h_irq0/jtag_uart.irq irqNumber 2
add_connection hps_0.f2h_irq1 ad9276_spi.irq interrupt
set_connection_parameter_value hps_0.f2h_irq1/ad9276_spi.irq irqNumber 0
add_connection hps_0.f2h_irq1 mux_spi.irq interrupt
set_connection_parameter_value hps_0.f2h_irq1/mux_spi.irq irqNumber 1
add_connection ILC.irq button_pio.irq interrupt
set_connection_parameter_value ILC.irq/button_pio.irq irqNumber 1
add_connection ILC.irq dipsw_pio.irq interrupt
set_connection_parameter_value ILC.irq/dipsw_pio.irq irqNumber 2
add_connection ILC.irq jtag_uart.irq interrupt
set_connection_parameter_value ILC.irq/jtag_uart.irq irqNumber 0

# exported interfaces
add_interface ad9276_spi_external conduit end
set_interface_property ad9276_spi_external EXPORT_OF ad9276_spi.external
add_interface adc_init_delay conduit end
set_interface_property adc_init_delay EXPORT_OF ADC_INIT_DELAY.external_connection
add_interface adc_samples_per_echo conduit end
set_interface_property adc_samples_per_echo EXPORT_OF ADC_SAMPLES_PER_ECHO.external_connection
add_interface adc_start_pulselength conduit end
set_interface_property adc_start_pulselength EXPORT_OF ADC_START_pulselength.external_connection
add_interface button_pio_external_connection conduit end
set_interface_property button_pio_external_connection EXPORT_OF button_pio.external_connection
add_interface clk clock sink
set_interface_property clk EXPORT_OF clk_0.clk_in
add_interface dipsw_pio_external_connection conduit end
set_interface_property dipsw_pio_external_connection EXPORT_OF dipsw_pio.external_connection
add_interface fifo_sink_clk_in clock sink
set_interface_property fifo_sink_clk_in EXPORT_OF fifo_clk_bridge.in_clk
add_interface fifo_sink_in_ch_a avalon_streaming sink
set_interface_property fifo_sink_in_ch_a EXPORT_OF fifo_sink_st_CH_A.in
add_interface fifo_sink_in_ch_b avalon_streaming sink
set_interface_property fifo_sink_in_ch_b EXPORT_OF fifo_sink_st_CH_B.in
add_interface fifo_sink_in_ch_c avalon_streaming sink
set_interface_property fifo_sink_in_ch_c EXPORT_OF fifo_sink_st_CH_C.in
add_interface fifo_sink_in_ch_d avalon_streaming sink
set_interface_property fifo_sink_in_ch_d EXPORT_OF fifo_sink_st_CH_D.in
add_interface fifo_sink_in_ch_e avalon_streaming sink
set_interface_property fifo_sink_in_ch_e EXPORT_OF fifo_sink_st_CH_E.in
add_interface fifo_sink_in_ch_f avalon_streaming sink
set_interface_property fifo_sink_in_ch_f EXPORT_OF fifo_sink_st_CH_F.in
add_interface fifo_sink_in_ch_g avalon_streaming sink
set_interface_property fifo_sink_in_ch_g EXPORT_OF fifo_sink_st_CH_G.in
add_interface fifo_sink_in_ch_h avalon_streaming sink
set_interface_property fifo_sink_in_ch_h EXPORT_OF fifo_sink_st_CH_H.in
add_interface general_cnt_in conduit end
set_interface_property general_cnt_in EXPORT_OF general_cnt_in.external_connection
add_interface general_cnt_out conduit end
set_interface_property general_cnt_out EXPORT_OF general_cnt_out.external_connection
add_interface hps_0_f2h_cold_reset_req reset sink
set_interface_property hps_0_f2h_cold_reset_req EXPORT_OF hps_0.f2h_cold_reset_req
add_interface hps_0_f2h_debug_reset_req reset sink
set_interface_property hps_0_f2h_debug_reset_req EXPORT_OF hps_0.f2h_debug_reset_req
add_interface hps_0_f2h_stm_hw_events conduit end
set_interface_property hps_0_f2h_stm_hw_events EXPORT_OF hps_0.f2h_stm_hw_events
add_interface hps_0_f2h_warm_reset_req reset sink
set_interface_property hps_0_f2h_warm_reset_req EXPORT_OF hps_0.f2h_warm_reset_req
add_interface hps_0_h2f_reset reset source
set_interface_property hps_0_h2f_reset EXPORT_OF hps_0.h2f_reset
add_interface hps_0_hps_io conduit end
set_interface_property hps_0_hps_io EXPORT_OF hps_0.hps_io
add_interface led_pio_external_connection conduit end
set_interface_property led_pio_external_connection EXPORT_OF led_pio.external_connection
add_interface memory conduit end
set_interface_property memory EXPORT_OF hps_0.memory
add_interface mux_spi conduit end
set_interface_property mux_spi EXPORT_OF mux_spi.external
add_interface pulse_damp_len conduit end
set_interface_property pulse_damp_len EXPORT_OF pulse_damp_len.external_connection
add_interface pulse_init_delay conduit end
set_interface_property pulse_init_delay EXPORT_OF pulse_init_delay.external_connection
add_interface pulse_pll_locked conduit end
set_interface_property pulse_pll_locked EXPORT_OF pulse_pll.locked
add_interface pulse_pll_out clock source
set_interface_property pulse_pll_out EXPORT_OF pulse_pll.outclk0
add_interface pulse_tx_len conduit end
set_interface_property pulse_tx_len EXPORT_OF pulse_tx_len.external_connection
add_interface reset reset sink
set_interface_property reset EXPORT_OF clk_0.clk_in_reset

set_interconnect_requirement {$system} qsys_mm.clockCrossingAdapter HANDSHAKE
set_interconnect_requirement {$system} qsys_mm.maxAdditionalLatency 1

save_system soc_system.qsys
